# Altium schematic sheet Motor Interface.SchDoc
size 297 x 209 mm; CompanyName: Sainsbury Wellcome Centre; Organization: FabLab; Address1: Sainsbury Wellcome Centre; Address2: 25 Howland Street; Address3: London; Address4: W1T 4JG; DocumentNumber: 5; SheetNumber: 5; SheetTotal: 5; swcgroup: FabLab; Org: Sainsbury Wellcome Centre; Add1: 25 Howland Street; Add2: London; Add3: W1T 4JG; WebAddress: www.sainsburywellcome.org; SheetSize: A4; SheetName: Motor Interface
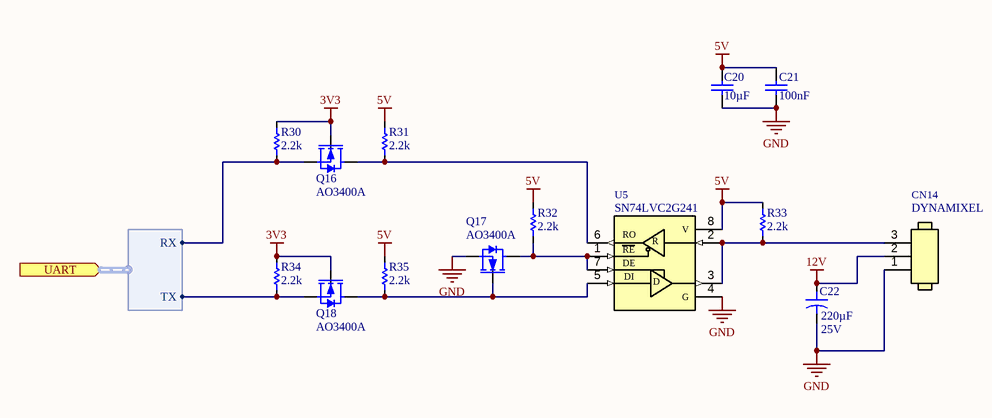
[diagram p0: Motor Interface.SchDoc]

## Parts
C20  value 10µF  [CAP_CHIP_0603]  (hidden comment: C0603-10uF-25V)
C21  value 100nF  [CAP_CHIP_0603]  (hidden comment: C0603-100nF-50V)
C22  value 220µF  Voltage Rating: 25V  [ECAP_SMD_6.3]  (hidden comment: SC63-220uF-25V)
CN14  DYNAMIXEL  [EH_90_1X3P]
Q16  AO3400A  [SOT23]
Q17  AO3400A  [SOT23]
Q18  AO3400A  [SOT23]
R30  value 2.2k  [RES_CHIP_0603]  (hidden comment: R0603-2K2)
R31  value 2.2k  [RES_CHIP_0603]  (hidden comment: R0603-2K2)
R32  value 2.2k  [RES_CHIP_0603]  (hidden comment: R0603-2K2)
R33  value 2.2k  [RES_CHIP_0603]  (hidden comment: R0603-2K2)
R34  value 2.2k  [RES_CHIP_0603]  (hidden comment: R0603-2K2)
R35  value 2.2k  [RES_CHIP_0603]  (hidden comment: R0603-2K2)
U5  SN74LVC2G241  [VSSOP8_2X2.3_0.5E]

## Ports
UART (in, harness UART)

## Harnesses
UART: TX, RX

## Nets
3V3: Q16.1(G) Q18.1(G) R30.2 R34.2
5V: C20.2 C21.2 R31.2 R32.2 R33.2 R35.2 U5.8(V)
12V: C22.1 CN14.2
GND: C20.1 C21.1 C22.2 CN14.1 Q17.2(S) U5.4(G)
NetCN14_3: CN14.3 R33.1 U5.2(1A) U5.3(B)
NetQ16_2: Q16.2(S) R30.1 ; port UART.RX
NetQ16_3: Q16.3(D) R31.1 U5.6(1Y)
NetQ17_1: Q17.1(G) Q18.3(D) R35.1 U5.5(D)
NetQ17_3: Q17.3(D) R32.1 U5.1(~{1OE}) U5.7(2OE)
NetQ18_2: Q18.2(S) R34.1 ; port UART.TX

## Notes on the sheet
- FILE
- VARIANT
- DATE
- REVISION
- SHEET
- /
- PROJECT
- SIZE
- (in symbol CMP-9C0-0006-1) RO; R; RE; DE; DI

## Library data of the parts
C20 = CMP-611-0050-6: 0603 Multilayer Ceramic Capacitors MLCC; PartNumber: CL10A106MA8NRNC; Dielectric: X5R; Pick&PlaceFootprint: C0603; Voltage Rating: 25V; Tolerance: 20%; Case/Package: 0603; LCSC Part N.: C96446; RoHS: Yes; Capacitor Type: Ceramic; Mount: SMD
C21 = CMP-611-0027-24: 0603 Multilayer Ceramic Capacitors MLCC; PartNumber: CC0603KRX7R9BB104; Tolerance: 10%; Pick&PlaceFootprint: C0603; Dielectric: X7R; Voltage Rating: 50V; Capacitor Type: Ceramic; RoHS: Yes; Mount: SMD; LCSC Part N.: C14663; Case/Package: 0603
C22 = CMP-610-0003-4: 25V 220uF ±20% SMD,D6.3xL7.7mm Solid Capacitors; PartNumber: HV1E477M0810PZ; Pick&PlaceFootprint: EC63; ESR (Equivalent Series Resistance): 35mR; Mount: Surface Mount; RoHS: Yes; Capacitor Type: Solid; LCSC Part N.: C5246541; Tolerance: 20%
CN14 = CMP-370-0057-1: Conn Shrouded Header (3 Sides) HDR 3 POS 2.5mm Solder RA Side Entry Thru-Hole Box; PartNumber: S3B-EH(LF)(SN); Gender: Male; Number of Positions: 3; Current Rating: 3A; Mount: through hole; Orientation: Right Angle; LCSC Part N.: C263754; Pitch: 2.5mm; Contact Plating: Tin; Number of Rows: 1; Contact Material: Copper, Tin; Number of Contacts: 3
Q16-Q18 = CMP-810-0002-2: 30V 5.7A 26.5mΩ@10V,5.7A 1.4W 1.5V@250uA 1 NChannel SOT-23-3L MOSFETs; Gate-Source Voltage (Vgs): 12V; Pick&PlaceFootprint: SOT-23; RDS(ON): 26.5mR; Switching Time: 34.5ns; LCSC Part N.: C20917; Drain-Source Voltage (Vds): 30V; Mount: Surface Mount; PartNumber: AO3400A; Power Dissipation: 1.4W; Drain Current (Id): 5.7A; Polarity: N Channel
R30-R35 = CMP-633-0070-21: 100mW Thick Film Resistors 75V ±100ppm/℃ ±1% 0603 Chip Resistor; PartNumber: 0603WAF2201T5E; Pick&PlaceFootprint: R0603; Number of Resistors: 1; Power Rating: 100mW; Mount: Surface Mount; Voltage Rating: 75V; Tolerance: 1%; LCSC Part N.: C4190; Case/Package: 0603
U5 = CMP-9C0-0006-1: Buffer/Line Driver 2-CH Non-Inverting 3-ST CMOS 8-Pin VSSOP T/R; PartNumber: SN74LVC2G241DCUR; Max Supply Voltage: 5.5V; Number of Channels: 2; Low Level Output Current: 32mA; Min Supply Voltage: 1.65V; Turn-On Delay Time: 12.5ns; Pick&PlaceFootprint: VSSOP8; High Level Output Current: -32mA; LCSC Part N.: C10430